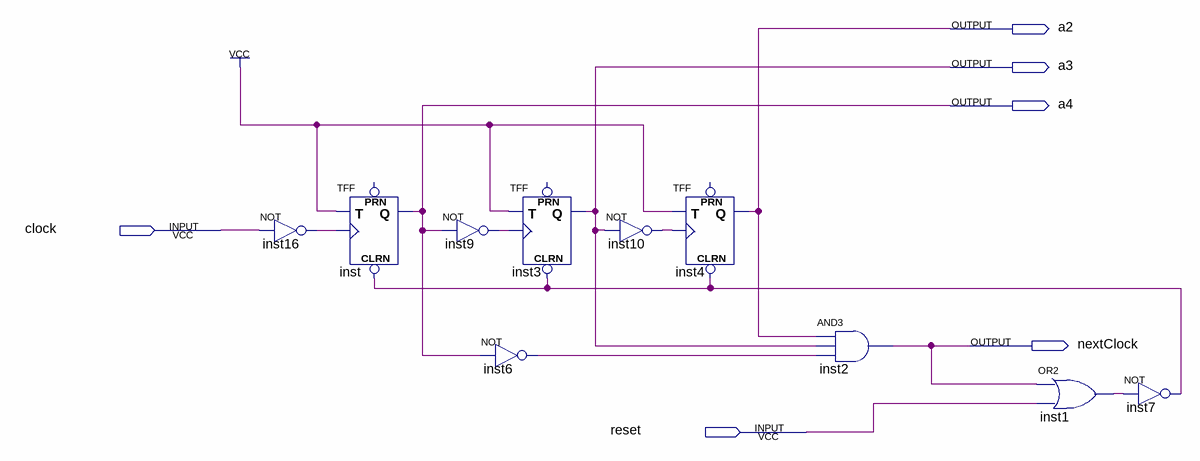
[diagram p0: schematic sheet]
// Quartus schematic oneDigitCounter0-5.bdf as structural Verilog: 10 symbols, 6 pins
module \oneDigitCounter0-5  (
  input  clock,
  input  reset,
  output a2,
  output a3,
  output a4,
  output nextClock
);

  wire inst1_out, inst6_out, inst7_out, inst9_out, inst10_out, inst16_out;

  not inst16 (inst16_out, clock);
  TFF inst (.CLRN(inst7_out), .T(1'b1), .CLK(inst16_out), .Q(a4));  // open: PRN
  not inst9 (inst9_out, a4);
  TFF inst3 (.CLRN(inst7_out), .T(1'b1), .CLK(inst9_out), .Q(a3));  // open: PRN
  not inst6 (inst6_out, a4);
  not inst10 (inst10_out, a3);
  TFF inst4 (.CLRN(inst7_out), .T(1'b1), .CLK(inst10_out), .Q(a2));  // open: PRN
  and inst2 (nextClock, a2, a3, inst6_out);
  or inst1 (inst1_out, nextClock, reset);
  not inst7 (inst7_out, inst1_out);
endmodule
